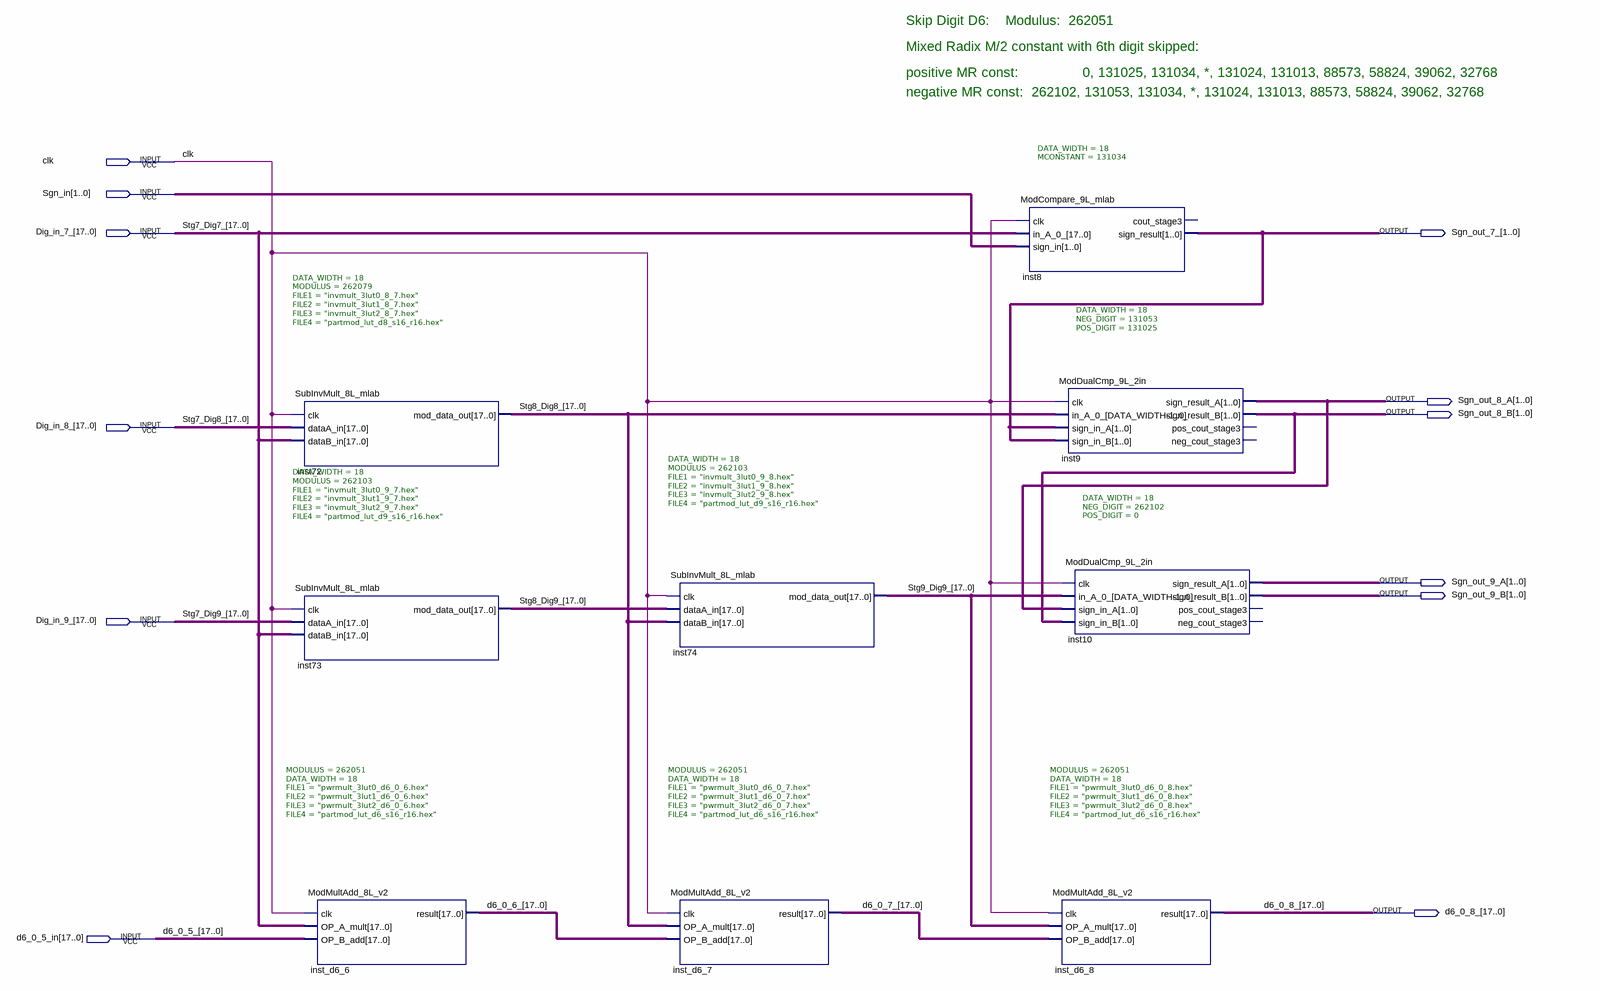
[diagram p0: schematic sheet]
// Quartus schematic MRC_pipe_mlab_ec_skp6.bdf as structural Verilog: 9 symbols, 12 pins
module MRC_pipe_mlab_ec_skp6 (
  input  clk,
  input  [1:0] Sgn_in,
  input  [17:0] Dig_in_7_,
  input  [17:0] Dig_in_8_,
  input  [17:0] Dig_in_9_,
  input  [17:0] d6_0_5_in,
  output [1:0] Sgn_out_7_,
  output [1:0] Sgn_out_8_A,
  output [1:0] Sgn_out_8_B,
  output [1:0] Sgn_out_9_A,
  output [1:0] Sgn_out_9_B,
  output [17:0] d6_0_8_
);

  wire [17:0] d6_0_6_, d6_0_7_, Stg8_Dig8_, Stg8_Dig9_, Stg9_Dig9_;

  SubInvMult_8L_mlab #(.DATA_WIDTH(18), .MODULUS(262079), .FILE1("invmult_3lut0_8_7.hex"), .FILE2("invmult_3lut1_8_7.hex"), .FILE3("invmult_3lut2_8_7.hex"), .FILE4("partmod_lut_d8_s16_r16.hex")) inst72 (
    .clk(clk), .dataA_in(Dig_in_8_), .dataB_in(Dig_in_7_), .mod_data_out(Stg8_Dig8_));
  SubInvMult_8L_mlab #(.DATA_WIDTH(18), .MODULUS(262103), .FILE1("invmult_3lut0_9_7.hex"), .FILE2("invmult_3lut1_9_7.hex"), .FILE3("invmult_3lut2_9_7.hex"), .FILE4("partmod_lut_d9_s16_r16.hex")) inst73 (
    .clk(clk), .dataA_in(Dig_in_9_), .dataB_in(Dig_in_7_), .mod_data_out(Stg8_Dig9_));
  ModMultAdd_8L_v2 #(.MODULUS(262051), .DATA_WIDTH(18), .FILE1("pwrmult_3lut0_d6_0_6.hex"), .FILE2("pwrmult_3lut1_d6_0_6.hex"), .FILE3("pwrmult_3lut2_d6_0_6.hex"), .FILE4("partmod_lut_d6_s16_r16.hex")) inst_d6_6 (
    .clk(clk), .OP_A_mult(Dig_in_7_), .OP_B_add(d6_0_5_in), .result(d6_0_6_));
  SubInvMult_8L_mlab #(.DATA_WIDTH(18), .MODULUS(262103), .FILE1("invmult_3lut0_9_8.hex"), .FILE2("invmult_3lut1_9_8.hex"), .FILE3("invmult_3lut2_9_8.hex"), .FILE4("partmod_lut_d9_s16_r16.hex")) inst74 (
    .clk(clk), .dataA_in(Stg8_Dig9_), .dataB_in(Stg8_Dig8_), .mod_data_out(Stg9_Dig9_));
  ModMultAdd_8L_v2 #(.MODULUS(262051), .DATA_WIDTH(18), .FILE1("pwrmult_3lut0_d6_0_7.hex"), .FILE2("pwrmult_3lut1_d6_0_7.hex"), .FILE3("pwrmult_3lut2_d6_0_7.hex"), .FILE4("partmod_lut_d6_s16_r16.hex")) inst_d6_7 (
    .clk(clk), .OP_A_mult(Stg8_Dig8_), .OP_B_add(d6_0_6_), .result(d6_0_7_));
  ModCompare_9L_mlab #(.DATA_WIDTH(18), .MCONSTANT(131034)) inst8 (
    .clk(clk), .in_A_0_(Dig_in_7_), .sign_in(Sgn_in), .sign_result(Sgn_out_7_));  // open: cout_stage3
  ModDualCmp_9L_2in #(.DATA_WIDTH(18), .NEG_DIGIT(131053), .POS_DIGIT(131025)) inst9 (
    .clk(clk), .in_A_0_(Stg8_Dig8_), .sign_in_A(Sgn_out_7_), .sign_in_B(Sgn_out_7_),
    .sign_result_A(Sgn_out_8_A), .sign_result_B(Sgn_out_8_B));  // open: pos_cout_stage3, neg_cout_stage3
  ModMultAdd_8L_v2 #(.MODULUS(262051), .DATA_WIDTH(18), .FILE1("pwrmult_3lut0_d6_0_8.hex"), .FILE2("pwrmult_3lut1_d6_0_8.hex"), .FILE3("pwrmult_3lut2_d6_0_8.hex"), .FILE4("partmod_lut_d6_s16_r16.hex")) inst_d6_8 (
    .clk(clk), .OP_A_mult(Stg9_Dig9_), .OP_B_add(d6_0_7_), .result(d6_0_8_));
  ModDualCmp_9L_2in #(.DATA_WIDTH(18), .NEG_DIGIT(262102), .POS_DIGIT(0)) inst10 (
    .clk(clk), .in_A_0_(Stg9_Dig9_), .sign_in_A(Sgn_out_8_A), .sign_in_B(Sgn_out_8_B),
    .sign_result_A(Sgn_out_9_A), .sign_result_B(Sgn_out_9_B));  // open: pos_cout_stage3, neg_cout_stage3

  // Other names for the same wires on the sheet: d6_0_5_[17:0] = d6_0_5_in; Stg7_Dig7_[17:0] = Dig_in_7_;
  //   Stg7_Dig8_[17:0] = Dig_in_8_; Stg7_Dig9_[17:0] = Dig_in_9_

  // Notes on the sheet:
  //   Skip Digit D6:    Modulus:  262051  
  //   Mixed Radix M/2 constant with 6th digit skipped:
  //   positive MR const:                0, 131025, 131034, *, 131024, 131013, 88573, 58824, 39062, 32768
  //   negative MR const:  262102, 131053, 131034, *, 131024, 131013, 88573, 58824, 39062, 32768
endmodule
